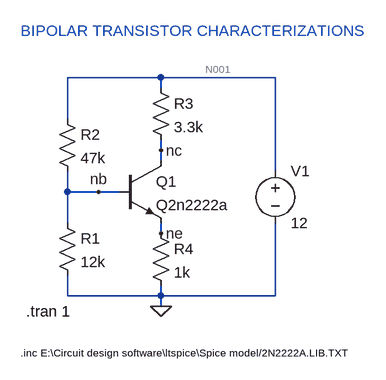
[diagram p0: schematic BJT_DC_transient.asc]
BJT_DC_transient.asc, the LTspice schematic file:
Version 4
SHEET 1 880 680
WIRE 192 -64 48 -64
WIRE 368 -64 192 -64
WIRE 192 -48 192 -64
WIRE 48 0 48 -64
WIRE 192 48 192 32
WIRE 192 64 192 48
WIRE 368 80 368 -64
WIRE 48 112 48 80
WIRE 96 112 48 112
WIRE 128 112 96 112
WIRE 48 160 48 112
WIRE 192 176 192 160
WIRE 48 272 48 240
WIRE 192 272 192 256
WIRE 192 272 48 272
WIRE 368 272 368 160
WIRE 368 272 192 272
WIRE 192 288 192 272
FLAG 192 288 0
FLAG 96 112 nb
FLAG 192 48 nc
FLAG 192 176 ne
SYMBOL npn3 128 64 R0
SYMATTR InstName Q1
SYMATTR Value Q2n2222a
SYMBOL res 32 144 R0
SYMATTR InstName R1
SYMATTR Value 12k
SYMBOL res 32 -16 R0
SYMATTR InstName R2
SYMATTR Value 47k
SYMBOL res 176 -64 R0
SYMATTR InstName R3
SYMATTR Value 3.3k
SYMBOL res 176 160 R0
SYMATTR InstName R4
SYMATTR Value 1k
SYMBOL voltage 368 64 R0
WINDOW 123 0 0 Left 0
WINDOW 39 0 0 Left 0
SYMATTR InstName V1
SYMATTR Value 12
TEXT -24 360 Left 1 !.inc E:\\Circuit design software\\ltspice\\Spice model/2N2222A.LIB.TXT
TEXT -16 296 Left 2 !.tran 1
TEXT -24 -136 Left 2 ;BIPOLAR TRANSISTOR CHARACTERIZATIONS

The netlist it stands for:
* BJT_DC_transient.asc
Q1 nc nb ne 0 Q2n2222a
R1 nb 0 12k
R2 N001 nb 47k
R3 N001 nc 3.3k
R4 ne 0 1k
V1 N001 0 12
.model NPN NPN
.model PNP PNP
.lib standard.bjt
.inc E:\Circuit design software\ltspice\Spice model/2N2222A.LIB.TXT
.tran 1
* BIPOLAR TRANSISTOR CHARACTERIZATIONS
.backanno
.end

* Results of the author's LTspice run, read from the files saved beside the schematic
* Operating Point, zero values left out:
*   V(nc) = 6.636 V
*   V(nb) = 2.332 V
*   V(ne) = 1.637 V
*   V(n001) = 12 V
*   Ic(Q1) = 1.626 mA
*   Ib(Q1) = 11.41 µA
*   Ie(Q1) = -1.637 mA
*   I(R4) = 1.637 mA
*   I(R3) = 1.626 mA
*   I(R2) = 205.7 µA
*   I(R1) = 194.3 µA
*   I(V1) = -1.831 mA